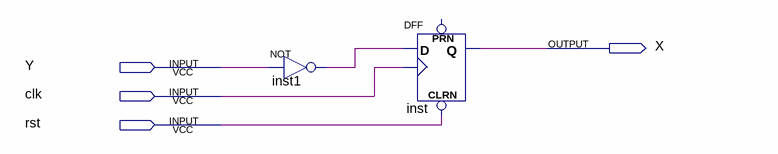
[diagram p0: schematic sheet]
// Quartus schematic statemachine.bdf as structural Verilog: 2 symbols, 4 pins
module statemachine (
  input  Y,
  input  clk,
  input  rst,
  output X
);

  wire inst1_out;

  not inst1 (inst1_out, Y);
  DFF inst (.CLRN(rst), .CLK(clk), .D(inst1_out), .Q(X));  // open: PRN
endmodule
